# Altium schematic sheet BCM_ECU.SchDoc
size D; SheetNumber: 1; SheetTotal: 15
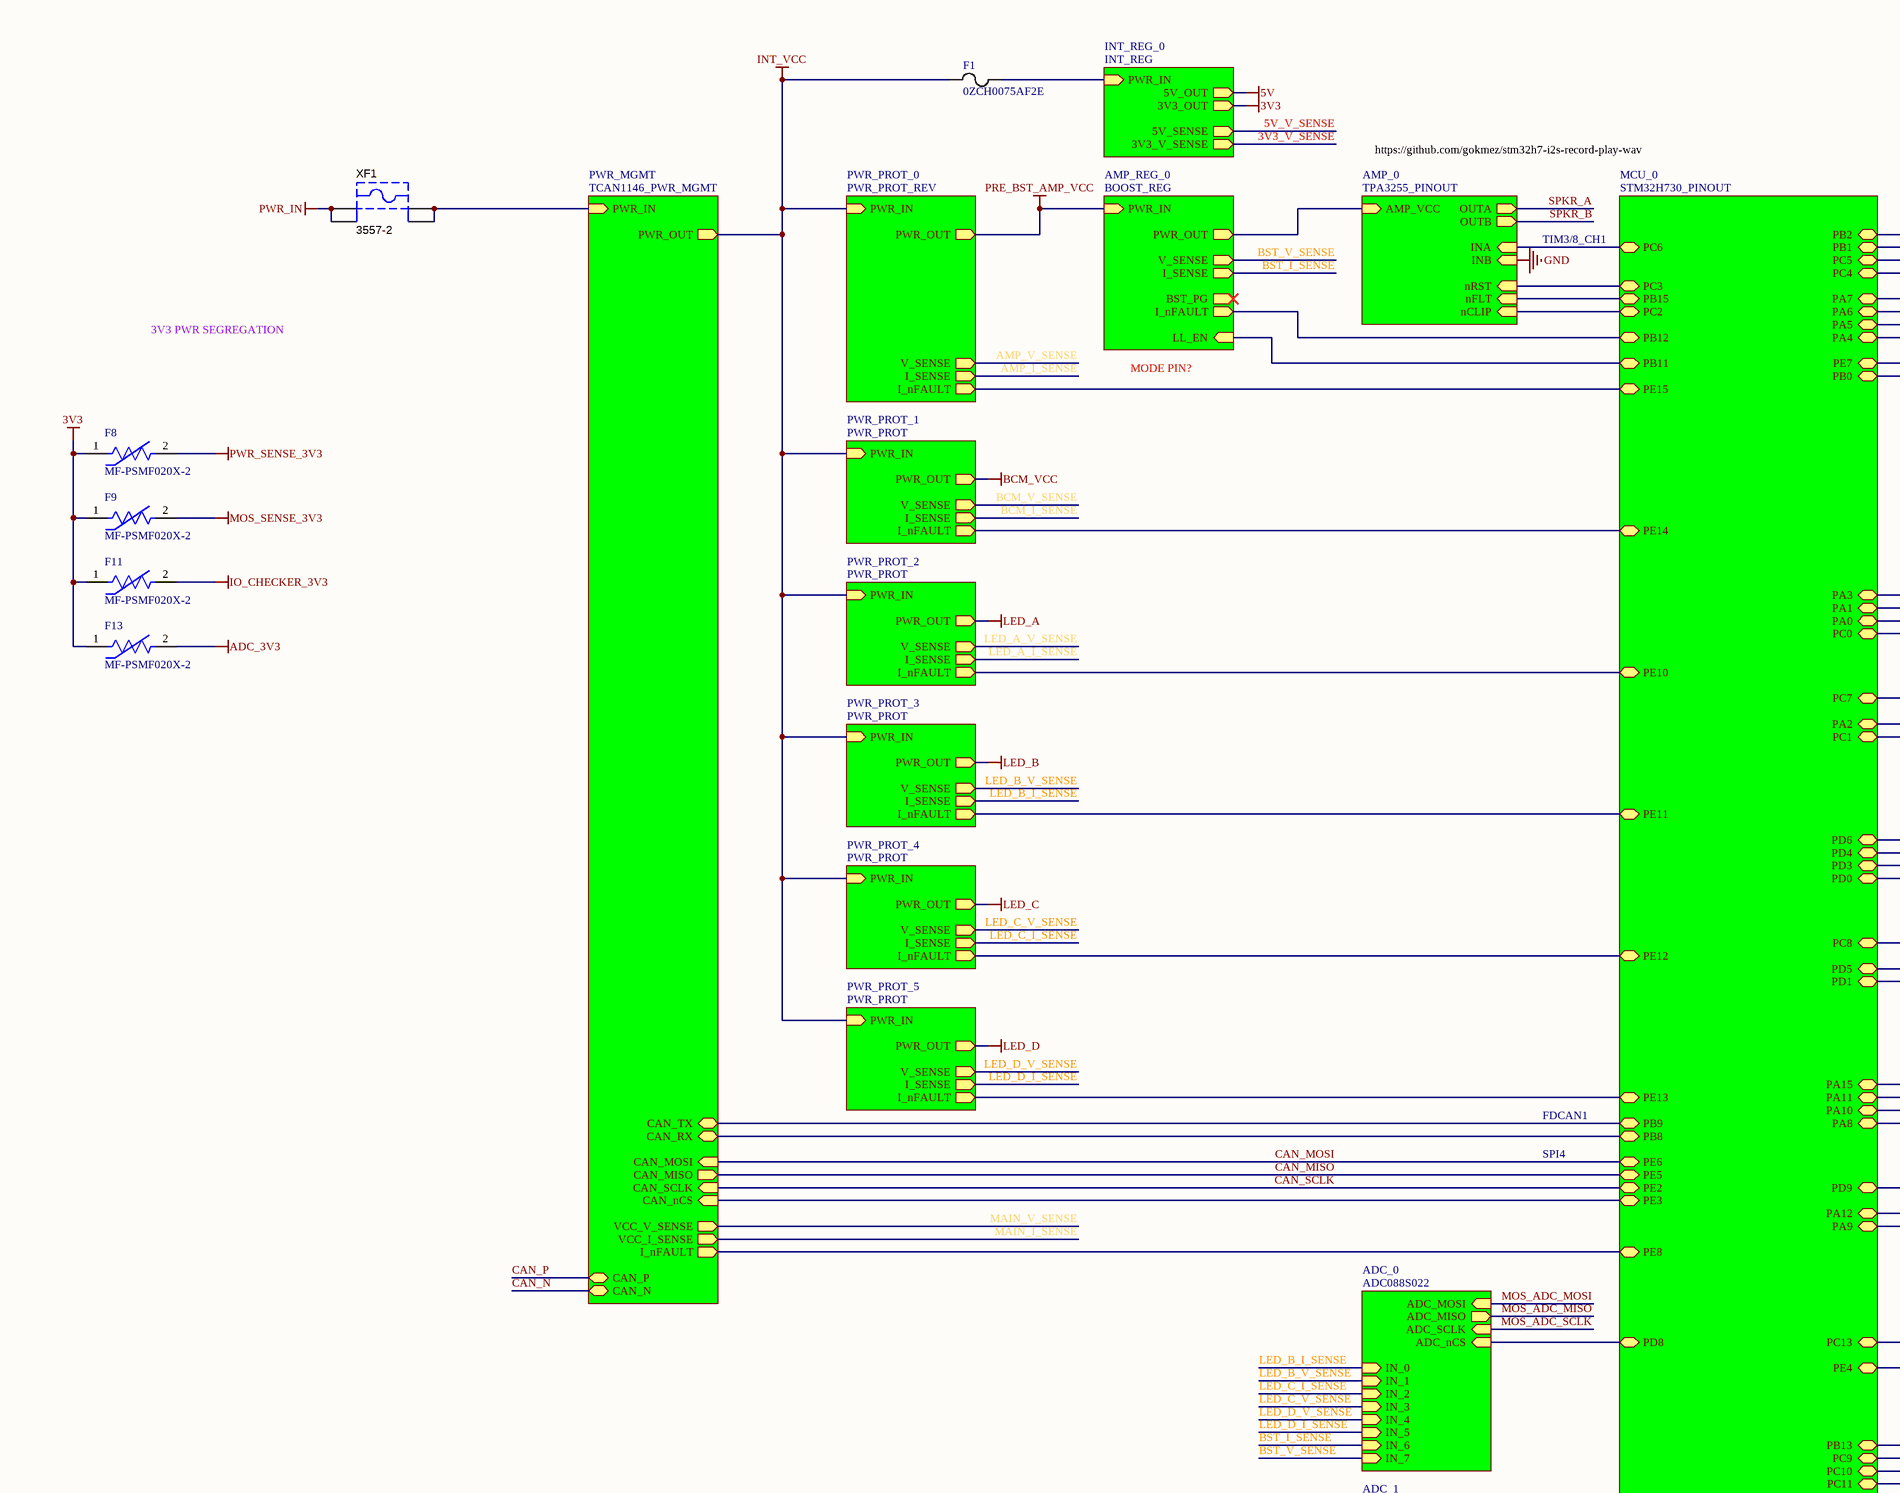
[diagram p0: BCM_ECU.SchDoc, top left]
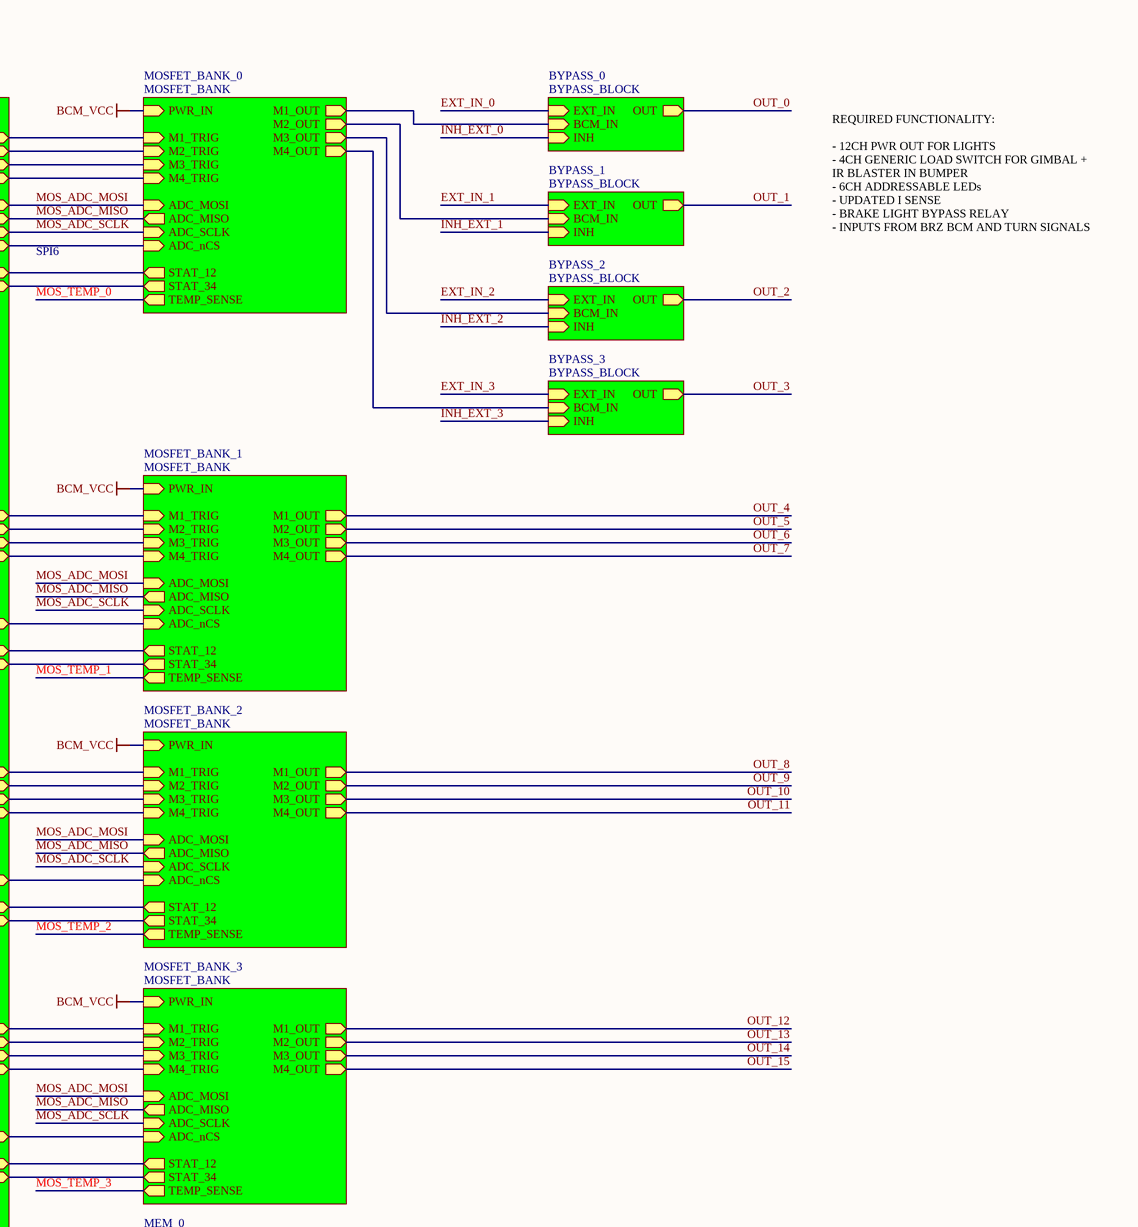
[diagram p1: BCM_ECU.SchDoc, top right]
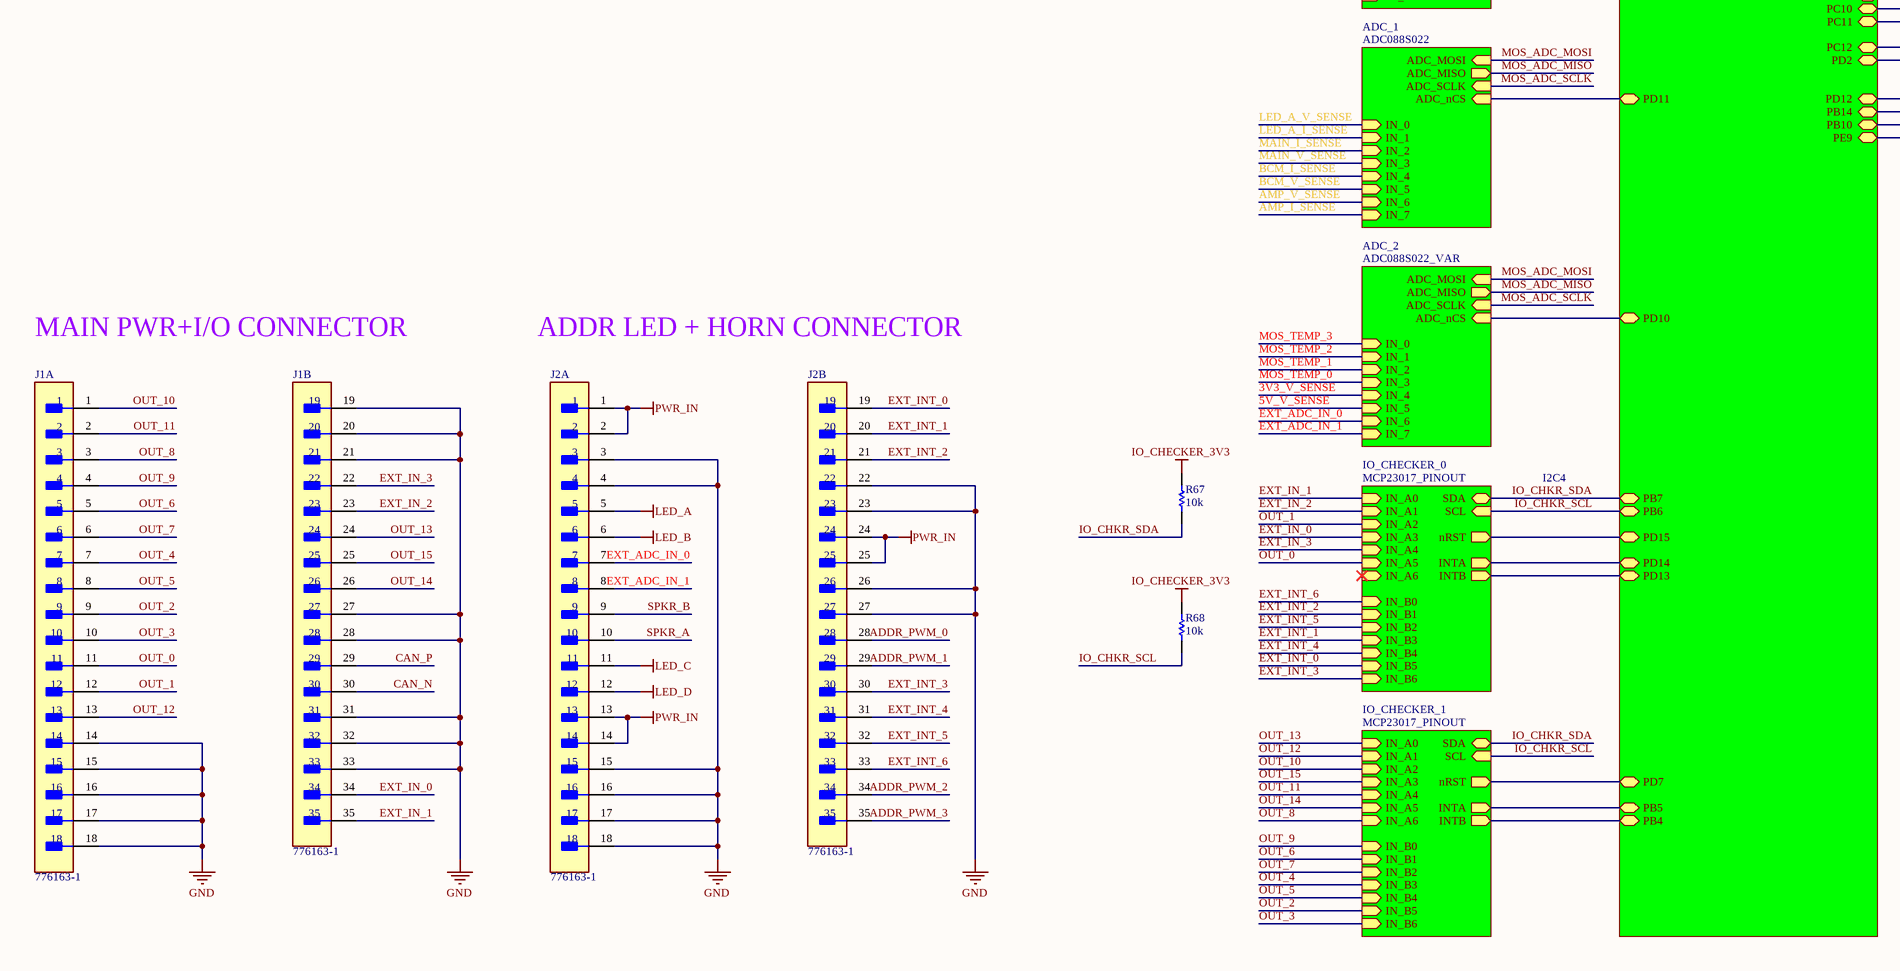
[diagram p2: BCM_ECU.SchDoc, bottom left]
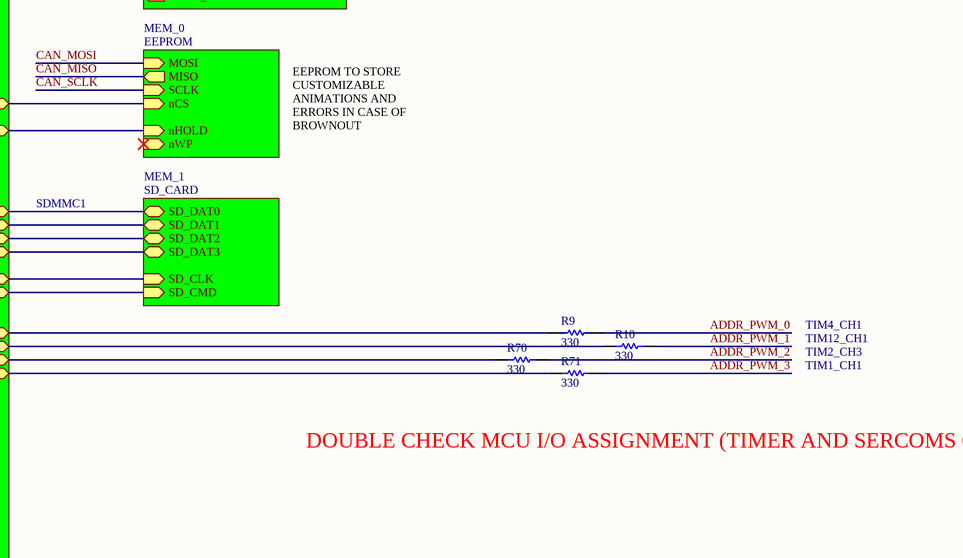
[diagram p3: BCM_ECU.SchDoc, bottom right]

## Parts
F1  0ZCH0075AF2E  [0ZCH0075AF2E-Footprint-1]
F8  MF-PSMF020X-2  [FP-MF-PSMF-MFG]
F9  MF-PSMF020X-2  [FP-MF-PSMF-MFG]
F11  MF-PSMF020X-2  [FP-MF-PSMF-MFG]
F13  MF-PSMF020X-2  [FP-MF-PSMF-MFG]
J1  776163-1  [FP-776163-1-MFG]  (parts A,B of 2)
J2  776163-1  [FP-776163-1-MFG]  (parts A,B of 2)
R9  330  [R0603B]
R10  330  [R0603B]
R67  10k  [R0603B]
R68  10k  [R0603B]
R70  330  [R0603B]
R71  330  [R0603B]
XF1  3557-2  [KSTN-3557-2]

## Sub-sheets
ADC_0 = ADC088S022: IN_0 (in), IN_1 (in), IN_2 (in), IN_3 (in), IN_4 (in), IN_5 (in), IN_6 (in), IN_7 (in), ADC_MOSI (in), ADC_MISO (out), ADC_SCLK (in), ADC_nCS (in)
ADC_1 = ADC088S022: IN_0 (in), IN_1 (in), IN_2 (in), IN_3 (in), IN_4 (in), IN_5 (in), IN_6 (in), IN_7 (in), ADC_MOSI (in), ADC_MISO (out), ADC_SCLK (in), ADC_nCS (in)
ADC_2 = ADC088S022_VAR: IN_0 (in), IN_1 (in), IN_2 (in), IN_3 (in), IN_4 (in), IN_5 (in), IN_6 (in), IN_7 (in), ADC_MOSI (in), ADC_MISO (out), ADC_SCLK (in), ADC_nCS (in)
AMP_0 = TPA3255_PINOUT: INA (in), nRST (in), nCLIP (in), nFLT (in), OUTA (out), OUTB (out), AMP_VCC (in), INB (in)
AMP_REG_0 = BOOST_REG: PWR_IN (in), PWR_OUT (out), I_SENSE (out), V_SENSE (out), I_nFAULT (out), LL_EN (in), BST_PG (out)
BYPASS_0 = BYPASS_BLOCK: EXT_IN (in), OUT (out), INH (in), BCM_IN (in)
BYPASS_1 = BYPASS_BLOCK: EXT_IN (in), OUT (out), INH (in), BCM_IN (in)
BYPASS_2 = BYPASS_BLOCK: EXT_IN (in), OUT (out), INH (in), BCM_IN (in)
BYPASS_3 = BYPASS_BLOCK: EXT_IN (in), OUT (out), INH (in), BCM_IN (in)
INT_REG_0 = INT_REG: PWR_IN (in), 3V3_OUT (out), 3V3_V_SENSE (out), 5V_SENSE (out), 5V_OUT (out)
IO_CHECKER_0 = MCP23017_PINOUT: IN_A0 (in), IN_A1 (in), IN_A2 (in), IN_A3 (in), IN_A4 (in), IN_A5 (in), IN_A6 (in), IN_B0 (in), IN_B1 (in), IN_B2 (in), IN_B3 (in), IN_B4 (in), IN_B5 (in), IN_B6 (in), SDA (bidir), SCL (in), nRST (out), INTA (out), INTB (out)
IO_CHECKER_1 = MCP23017_PINOUT: IN_A0 (in), IN_A1 (in), IN_A2 (in), IN_A3 (in), IN_A4 (in), IN_A5 (in), IN_A6 (in), IN_B0 (in), IN_B1 (in), IN_B2 (in), IN_B3 (in), IN_B4 (in), IN_B5 (in), IN_B6 (in), SDA (bidir), SCL (in), nRST (out), INTA (out), INTB (out)
MCU_0 = STM32H730_PINOUT: PB13 (bidir), PC9 (bidir), PC10 (bidir), PC11 (bidir), PC12 (bidir), PD2 (bidir), PA5 (bidir), PA6 (bidir), PA7 (bidir), PB6 (bidir), PB7 (bidir), PE2 (bidir), PE5 (bidir), PE6 (bidir), PB8 (bidir), PB9 (bidir), PB5 (bidir), PB4 (bidir), PD7 (bidir), PD6 (bidir), PD5 (bidir), PD4 (bidir), PD3 (bidir), PD1 (bidir), PD0 (bidir), PA15 (bidir), PA12 (bidir), PA11 (bidir), PA10 (bidir), PA9 (bidir), PA8 (bidir), PE3 (bidir), PE4 (bidir), PC13 (bidir), PC0 (bidir), PC1 (bidir), PA0 (bidir), PA1 (bidir), PA2 (bidir), PA3 (bidir), PC8 (bidir), PC7 (bidir), PC6 (bidir), PA4 (bidir), PC4 (bidir), PC5 (bidir), PB0 (bidir), PB1 (bidir), PB2 (bidir), PE7 (bidir), PD15 (bidir), PD14 (bidir), PD13 (bidir), PD11 (bidir), PD10 (bidir), PD8 (bidir), PE8 (bidir), PE10 (bidir), PE11 (bidir), PE12 (bidir), PE13 (bidir), PE14 (bidir), PD12 (bidir), PB14 (bidir), PB10 (bidir), PE9 (bidir), PE15 (bidir), PB11 (bidir), PD9 (bidir), PB12 (bidir), PB15 (bidir), PC2 (bidir), PC3 (bidir)
MEM_0 = EEPROM: MOSI (in), MISO (out), SCLK (in), nCS (in), nHOLD (in), nWP (in)
MEM_1 = SD_CARD: SD_DAT0 (bidir), SD_DAT1 (bidir), SD_DAT3 (bidir), SD_DAT2 (bidir), SD_CLK (in), SD_CMD (in)
MOSFET_BANK_0 = MOSFET_BANK: M1_OUT (out), M2_OUT (out), M3_OUT (out), M4_OUT (out), M1_TRIG (in), M2_TRIG (in), M3_TRIG (in), M4_TRIG (in), STAT_12 (out), STAT_34 (out), ADC_MOSI (in), ADC_MISO (out), ADC_SCLK (in), ADC_nCS (in), TEMP_SENSE (out), PWR_IN (in)
MOSFET_BANK_1 = MOSFET_BANK: M1_OUT (out), M2_OUT (out), M3_OUT (out), M4_OUT (out), M1_TRIG (in), M2_TRIG (in), M3_TRIG (in), M4_TRIG (in), STAT_12 (out), STAT_34 (out), ADC_MOSI (in), ADC_MISO (out), ADC_SCLK (in), ADC_nCS (in), TEMP_SENSE (out), PWR_IN (in)
MOSFET_BANK_2 = MOSFET_BANK: M1_OUT (out), M2_OUT (out), M3_OUT (out), M4_OUT (out), M1_TRIG (in), M2_TRIG (in), M3_TRIG (in), M4_TRIG (in), STAT_12 (out), STAT_34 (out), ADC_MOSI (in), ADC_MISO (out), ADC_SCLK (in), ADC_nCS (in), TEMP_SENSE (out), PWR_IN (in)
MOSFET_BANK_3 = MOSFET_BANK: M1_OUT (out), M2_OUT (out), M3_OUT (out), M4_OUT (out), M1_TRIG (in), M2_TRIG (in), M3_TRIG (in), M4_TRIG (in), STAT_12 (out), STAT_34 (out), ADC_MOSI (in), ADC_MISO (out), ADC_SCLK (in), ADC_nCS (in), TEMP_SENSE (out), PWR_IN (in)
PWR_MGMT = TCAN1146_PWR_MGMT: PWR_IN (in), PWR_OUT (out), CAN_TX (bidir), CAN_RX (bidir), CAN_MOSI (in), CAN_MISO (out), CAN_SCLK (in), CAN_nCS (in), VCC_V_SENSE (out), VCC_I_SENSE (out), I_nFAULT (out), CAN_P (bidir), CAN_N (bidir)
PWR_PROT_0 = PWR_PROT_REV: PWR_IN (in), PWR_OUT (out), V_SENSE (out), I_SENSE (out), I_nFAULT (out)
PWR_PROT_1 = PWR_PROT: PWR_IN (in), PWR_OUT (out), V_SENSE (out), I_SENSE (out), I_nFAULT (out)
PWR_PROT_2 = PWR_PROT: PWR_IN (in), PWR_OUT (out), V_SENSE (out), I_SENSE (out), I_nFAULT (out)
PWR_PROT_3 = PWR_PROT: PWR_IN (in), PWR_OUT (out), V_SENSE (out), I_SENSE (out), I_nFAULT (out)
PWR_PROT_4 = PWR_PROT: PWR_IN (in), PWR_OUT (out), V_SENSE (out), I_SENSE (out), I_nFAULT (out)
PWR_PROT_5 = PWR_PROT: PWR_IN (in), PWR_OUT (out), V_SENSE (out), I_SENSE (out), I_nFAULT (out)

## Nets
3V3: F8.1 F9.1 F11.1 F13.1 ; sheet INT_REG_0/3V3_OUT
5V: sheet INT_REG_0/5V_OUT
ADC_3V3: F13.2
BCM_VCC: sheet MOSFET_BANK_0/PWR_IN, sheet MOSFET_BANK_1/PWR_IN, sheet MOSFET_BANK_2/PWR_IN, sheet MOSFET_BANK_3/PWR_IN, sheet PWR_PROT_1/PWR_OUT
GND: J1.14 J1.15 J1.16 J1.17 J1.18 J1.19 J1.20 J1.21 J1.27 J1.28 J1.31 J1.32 J1.33 J2.3 J2.4 J2.15 J2.16 J2.17 J2.18 J2.22 J2.23 J2.26 J2.27 ; sheet AMP_0/INB
INT_VCC: F1.1 ; sheet PWR_MGMT/PWR_OUT, sheet PWR_PROT_0/PWR_IN, sheet PWR_PROT_1/PWR_IN, sheet PWR_PROT_2/PWR_IN, sheet PWR_PROT_3/PWR_IN, sheet PWR_PROT_4/PWR_IN, sheet PWR_PROT_5/PWR_IN
IO_CHECKER_3V3: F11.2 R67.2 R68.2
LED_A: J2.5 ; sheet PWR_PROT_2/PWR_OUT
LED_B: J2.6 ; sheet PWR_PROT_3/PWR_OUT
LED_C: J2.11 ; sheet PWR_PROT_4/PWR_OUT
LED_D: J2.12 ; sheet PWR_PROT_5/PWR_OUT
MOS_SENSE_3V3: F9.2
PRE_BST_AMP_VCC: sheet AMP_REG_0/PWR_IN, sheet PWR_PROT_0/PWR_OUT
PWR_IN: J2.1 J2.2 J2.13 J2.14 J2.24 J2.25 XF1.1 XF1.2
PWR_SENSE_3V3: F8.2
3V3_V_SENSE: sheet INT_REG_0/3V3_V_SENSE, sheet ADC_2/IN_4
5V_V_SENSE: sheet INT_REG_0/5V_SENSE, sheet ADC_2/IN_5
ADDR_PWM_0: J2.28 R9.1
ADDR_PWM_1: J2.29 R10.1
ADDR_PWM_2: J2.34 R70.1
ADDR_PWM_3: J2.35 R71.1
AMP_I_SENSE: sheet PWR_PROT_0/I_SENSE, sheet ADC_1/IN_7
AMP_V_SENSE: sheet PWR_PROT_0/V_SENSE, sheet ADC_1/IN_6
BCM_I_SENSE: sheet PWR_PROT_1/I_SENSE, sheet ADC_1/IN_4
BCM_V_SENSE: sheet PWR_PROT_1/V_SENSE, sheet ADC_1/IN_5
BST_I_SENSE: sheet ADC_0/IN_6, sheet AMP_REG_0/I_SENSE
BST_V_SENSE: sheet ADC_0/IN_7, sheet AMP_REG_0/V_SENSE
CAN_MISO: sheet MCU_0/PE5, sheet PWR_MGMT/CAN_MISO, sheet MEM_0/MISO
CAN_MOSI: sheet MCU_0/PE6, sheet PWR_MGMT/CAN_MOSI, sheet MEM_0/MOSI
CAN_N: J1.30 ; sheet PWR_MGMT/CAN_N
CAN_P: J1.29 ; sheet PWR_MGMT/CAN_P
CAN_SCLK: sheet MCU_0/PE2, sheet PWR_MGMT/CAN_SCLK, sheet MEM_0/SCLK
EXT_ADC_IN_0: J2.7 ; sheet ADC_2/IN_6
EXT_ADC_IN_1: J2.8 ; sheet ADC_2/IN_7
EXT_IN_0: J1.34 ; sheet BYPASS_0/EXT_IN, sheet IO_CHECKER_0/IN_A3
EXT_IN_1: J1.35 ; sheet BYPASS_1/EXT_IN, sheet IO_CHECKER_0/IN_A0
EXT_IN_2: J1.23 ; sheet BYPASS_2/EXT_IN, sheet IO_CHECKER_0/IN_A1
EXT_IN_3: J1.22 ; sheet BYPASS_3/EXT_IN, sheet IO_CHECKER_0/IN_A4
EXT_INT_0: J2.19 ; sheet IO_CHECKER_0/IN_B5
EXT_INT_1: J2.20 ; sheet IO_CHECKER_0/IN_B3
EXT_INT_2: J2.21 ; sheet IO_CHECKER_0/IN_B1
EXT_INT_3: J2.30 ; sheet IO_CHECKER_0/IN_B6
EXT_INT_4: J2.31 ; sheet IO_CHECKER_0/IN_B4
EXT_INT_5: J2.32 ; sheet IO_CHECKER_0/IN_B2
EXT_INT_6: J2.33 ; sheet IO_CHECKER_0/IN_B0
INH_EXT_0: sheet BYPASS_0/INH
INH_EXT_1: sheet BYPASS_1/INH
INH_EXT_2: sheet BYPASS_2/INH
INH_EXT_3: sheet BYPASS_3/INH
IO_CHKR_SCL: R68.1 ; sheet MCU_0/PB6, sheet IO_CHECKER_0/SCL, sheet IO_CHECKER_1/SCL
IO_CHKR_SDA: R67.1 ; sheet MCU_0/PB7, sheet IO_CHECKER_0/SDA, sheet IO_CHECKER_1/SDA
LED_A_I_SENSE: sheet PWR_PROT_2/I_SENSE, sheet ADC_1/IN_1
LED_A_V_SENSE: sheet PWR_PROT_2/V_SENSE, sheet ADC_1/IN_0
LED_B_I_SENSE: sheet ADC_0/IN_0, sheet PWR_PROT_3/I_SENSE
LED_B_V_SENSE: sheet ADC_0/IN_1, sheet PWR_PROT_3/V_SENSE
LED_C_I_SENSE: sheet ADC_0/IN_2, sheet PWR_PROT_4/I_SENSE
LED_C_V_SENSE: sheet ADC_0/IN_3, sheet PWR_PROT_4/V_SENSE
LED_D_I_SENSE: sheet ADC_0/IN_5, sheet PWR_PROT_5/I_SENSE
LED_D_V_SENSE: sheet ADC_0/IN_4, sheet PWR_PROT_5/V_SENSE
MAIN_I_SENSE: sheet PWR_MGMT/VCC_I_SENSE, sheet ADC_1/IN_2
MAIN_V_SENSE: sheet PWR_MGMT/VCC_V_SENSE, sheet ADC_1/IN_3
MOS_ADC_MISO: sheet MCU_0/PA6, sheet MOSFET_BANK_0/ADC_MISO, sheet MOSFET_BANK_1/ADC_MISO, sheet MOSFET_BANK_2/ADC_MISO, sheet ADC_0/ADC_MISO, sheet MOSFET_BANK_3/ADC_MISO, sheet ADC_1/ADC_MISO, sheet ADC_2/ADC_MISO
MOS_ADC_MOSI: sheet MCU_0/PA7, sheet MOSFET_BANK_0/ADC_MOSI, sheet MOSFET_BANK_1/ADC_MOSI, sheet MOSFET_BANK_2/ADC_MOSI, sheet ADC_0/ADC_MOSI, sheet MOSFET_BANK_3/ADC_MOSI, sheet ADC_1/ADC_MOSI, sheet ADC_2/ADC_MOSI
MOS_ADC_SCLK: sheet MCU_0/PA5, sheet MOSFET_BANK_0/ADC_SCLK, sheet MOSFET_BANK_1/ADC_SCLK, sheet MOSFET_BANK_2/ADC_SCLK, sheet ADC_0/ADC_SCLK, sheet MOSFET_BANK_3/ADC_SCLK, sheet ADC_1/ADC_SCLK, sheet ADC_2/ADC_SCLK
MOS_TEMP_0: sheet MOSFET_BANK_0/TEMP_SENSE, sheet ADC_2/IN_3
MOS_TEMP_1: sheet MOSFET_BANK_1/TEMP_SENSE, sheet ADC_2/IN_2
MOS_TEMP_2: sheet MOSFET_BANK_2/TEMP_SENSE, sheet ADC_2/IN_1
MOS_TEMP_3: sheet MOSFET_BANK_3/TEMP_SENSE, sheet ADC_2/IN_0
OUT_0: J1.11 ; sheet BYPASS_0/OUT, sheet IO_CHECKER_0/IN_A5
OUT_1: J1.12 ; sheet BYPASS_1/OUT, sheet IO_CHECKER_0/IN_A2
OUT_2: J1.9 ; sheet BYPASS_2/OUT, sheet IO_CHECKER_1/IN_B5
OUT_3: J1.10 ; sheet BYPASS_3/OUT, sheet IO_CHECKER_1/IN_B6
OUT_4: J1.7 ; sheet MOSFET_BANK_1/M1_OUT, sheet IO_CHECKER_1/IN_B3
OUT_5: J1.8 ; sheet MOSFET_BANK_1/M2_OUT, sheet IO_CHECKER_1/IN_B4
OUT_6: J1.5 ; sheet MOSFET_BANK_1/M3_OUT, sheet IO_CHECKER_1/IN_B1
OUT_7: J1.6 ; sheet MOSFET_BANK_1/M4_OUT, sheet IO_CHECKER_1/IN_B2
OUT_8: J1.3 ; sheet MOSFET_BANK_2/M1_OUT, sheet IO_CHECKER_1/IN_A6
OUT_9: J1.4 ; sheet MOSFET_BANK_2/M2_OUT, sheet IO_CHECKER_1/IN_B0
OUT_10: J1.1 ; sheet MOSFET_BANK_2/M3_OUT, sheet IO_CHECKER_1/IN_A2
OUT_11: J1.2 ; sheet MOSFET_BANK_2/M4_OUT, sheet IO_CHECKER_1/IN_A4
OUT_12: J1.13 ; sheet MOSFET_BANK_3/M1_OUT, sheet IO_CHECKER_1/IN_A1
OUT_13: J1.24 ; sheet MOSFET_BANK_3/M2_OUT, sheet IO_CHECKER_1/IN_A0
OUT_14: J1.26 ; sheet MOSFET_BANK_3/M3_OUT, sheet IO_CHECKER_1/IN_A5
OUT_15: J1.25 ; sheet MOSFET_BANK_3/M4_OUT, sheet IO_CHECKER_1/IN_A3
SPKR_A: J2.10 ; sheet AMP_0/OUTA
SPKR_B: J2.9 ; sheet AMP_0/OUTB
NetF1_2: F1.2 ; sheet INT_REG_0/PWR_IN
NetR9_2: R9.2 ; sheet MCU_0/PD12
NetR10_2: R10.2 ; sheet MCU_0/PB14
NetR70_2: R70.2 ; sheet MCU_0/PB10
NetR71_2: R71.2 ; sheet MCU_0/PE9
NetXF1_3: XF1.3 XF1.4 ; sheet PWR_MGMT/PWR_IN
(unnamed): sheet MCU_0/PB13, sheet MEM_1/SD_DAT0
(unnamed): sheet MCU_0/PC9, sheet MEM_1/SD_DAT1
(unnamed): sheet MCU_0/PC10, sheet MEM_1/SD_DAT2
(unnamed): sheet MCU_0/PC11, sheet MEM_1/SD_DAT3
(unnamed): sheet MCU_0/PC12, sheet MEM_1/SD_CLK
(unnamed): sheet MCU_0/PD2, sheet MEM_1/SD_CMD
(unnamed): sheet MCU_0/PB8, sheet PWR_MGMT/CAN_RX
(unnamed): sheet MCU_0/PB9, sheet PWR_MGMT/CAN_TX
(unnamed): sheet MCU_0/PB5, sheet IO_CHECKER_1/INTA
(unnamed): sheet MCU_0/PB4, sheet IO_CHECKER_1/INTB
(unnamed): sheet MCU_0/PD7, sheet IO_CHECKER_1/nRST
(unnamed): sheet MCU_0/PD6, sheet MOSFET_BANK_2/M1_TRIG
(unnamed): sheet MCU_0/PD5, sheet MOSFET_BANK_2/STAT_12
(unnamed): sheet MCU_0/PD4, sheet MOSFET_BANK_2/M2_TRIG
(unnamed): sheet MCU_0/PD3, sheet MOSFET_BANK_2/M3_TRIG
(unnamed): sheet MCU_0/PD1, sheet MOSFET_BANK_2/STAT_34
(unnamed): sheet MCU_0/PD0, sheet MOSFET_BANK_2/M4_TRIG
(unnamed): sheet MCU_0/PA15, sheet MOSFET_BANK_3/M1_TRIG
(unnamed): sheet MCU_0/PA12, sheet MOSFET_BANK_3/STAT_12
(unnamed): sheet MCU_0/PA11, sheet MOSFET_BANK_3/M2_TRIG
(unnamed): sheet MCU_0/PA10, sheet MOSFET_BANK_3/M3_TRIG
(unnamed): sheet MCU_0/PA9, sheet MOSFET_BANK_3/STAT_34
(unnamed): sheet MCU_0/PA8, sheet MOSFET_BANK_3/M4_TRIG
(unnamed): sheet MCU_0/PE3, sheet PWR_MGMT/CAN_nCS
(unnamed): sheet MCU_0/PE4, sheet MEM_0/nHOLD
(unnamed): sheet MCU_0/PC13, sheet MEM_0/nCS
(unnamed): sheet MCU_0/PC0, sheet MOSFET_BANK_1/M4_TRIG
(unnamed): sheet MCU_0/PC1, sheet MOSFET_BANK_1/STAT_34
(unnamed): sheet MCU_0/PA0, sheet MOSFET_BANK_1/M3_TRIG
(unnamed): sheet MCU_0/PA1, sheet MOSFET_BANK_1/M2_TRIG
(unnamed): sheet MCU_0/PA2, sheet MOSFET_BANK_1/STAT_12
(unnamed): sheet MCU_0/PA3, sheet MOSFET_BANK_1/M1_TRIG
(unnamed): sheet MCU_0/PC8, sheet MOSFET_BANK_2/ADC_nCS
(unnamed): sheet MCU_0/PC7, sheet MOSFET_BANK_1/ADC_nCS
(unnamed): sheet MCU_0/PC6, sheet AMP_0/INA
(unnamed): sheet MCU_0/PA4, sheet MOSFET_BANK_0/ADC_nCS
(unnamed): sheet MCU_0/PC4, sheet MOSFET_BANK_0/M4_TRIG
(unnamed): sheet MCU_0/PC5, sheet MOSFET_BANK_0/M3_TRIG
(unnamed): sheet MCU_0/PB0, sheet MOSFET_BANK_0/STAT_34
(unnamed): sheet MCU_0/PB1, sheet MOSFET_BANK_0/M2_TRIG
(unnamed): sheet MCU_0/PB2, sheet MOSFET_BANK_0/M1_TRIG
(unnamed): sheet MCU_0/PE7, sheet MOSFET_BANK_0/STAT_12
(unnamed): sheet MCU_0/PD15, sheet IO_CHECKER_0/nRST
(unnamed): sheet MCU_0/PD14, sheet IO_CHECKER_0/INTA
(unnamed): sheet MCU_0/PD13, sheet IO_CHECKER_0/INTB
(unnamed): sheet MCU_0/PD11, sheet ADC_1/ADC_nCS
(unnamed): sheet MCU_0/PD10, sheet ADC_2/ADC_nCS
(unnamed): sheet MCU_0/PD8, sheet ADC_0/ADC_nCS
(unnamed): sheet MCU_0/PE8, sheet PWR_MGMT/I_nFAULT
(unnamed): sheet MCU_0/PE10, sheet PWR_PROT_2/I_nFAULT
(unnamed): sheet MCU_0/PE11, sheet PWR_PROT_3/I_nFAULT
(unnamed): sheet MCU_0/PE12, sheet PWR_PROT_4/I_nFAULT
(unnamed): sheet MCU_0/PE13, sheet PWR_PROT_5/I_nFAULT
(unnamed): sheet MCU_0/PE14, sheet PWR_PROT_1/I_nFAULT
(unnamed): sheet MCU_0/PE15, sheet PWR_PROT_0/I_nFAULT
(unnamed): sheet MCU_0/PB11, sheet AMP_REG_0/LL_EN
(unnamed): sheet MCU_0/PD9, sheet MOSFET_BANK_3/ADC_nCS
(unnamed): sheet MCU_0/PB12, sheet AMP_REG_0/I_nFAULT
(unnamed): sheet MCU_0/PB15, sheet AMP_0/nFLT
(unnamed): sheet MCU_0/PC2, sheet AMP_0/nCLIP
(unnamed): sheet MCU_0/PC3, sheet AMP_0/nRST
(unnamed): sheet MOSFET_BANK_0/M1_OUT, sheet BYPASS_0/BCM_IN
(unnamed): sheet MOSFET_BANK_0/M2_OUT, sheet BYPASS_1/BCM_IN
(unnamed): sheet MOSFET_BANK_0/M3_OUT, sheet BYPASS_2/BCM_IN
(unnamed): sheet MOSFET_BANK_0/M4_OUT, sheet BYPASS_3/BCM_IN
(unnamed): sheet AMP_REG_0/PWR_OUT, sheet AMP_0/AMP_VCC

## Notes on the sheet
- https://github.com/gokmez/stm32h7-i2s-record-play-wav
- TIM3/8_CH1
- 3V3 PWR SEGREGATION
- SPI6
- REQUIRED FUNCTIONALITY:
  - 12CH PWR OUT FOR LIGHTS
  - 4CH GENERIC LOAD SWITCH FOR GIMBAL + IR BLASTER IN BUMPER
  - 6CH ADDRESSABLE LEDs
  - UPDATED I SENSE
  - BRAKE LIGHT BYPASS RELAY
  - INPUTS FROM BRZ BCM AND TURN SIGNALS
- MODE PIN?
- FDCAN1
- SPI4
- EEPROM TO STORE CUSTOMIZABLE ANIMATIONS AND ERRORS IN CASE OF BROWNOUT
- SDMMC1
- TIM4_CH1
- TIM12_CH1
- TIM2_CH3
- TIM1_CH1
- DOUBLE CHECK MCU I/O ASSIGNMENT (TIMER AND SERCOMS CORRECT)
- MAIN PWR+I/O CONNECTOR
- ADDR LED + HORN CONNECTOR
- I2C4

## Library data of the parts
F1 = CMP-005-00028-2: PTC Thermistor; RoHS Compliant: Yes
F8 F9 F11 F13 = CMP-07400-000005-1: PTC RESET FUSE 9V 200MA 0805; Manufacturer: Bourns; Trip Current: 0.5A; Resistance: 0.65-3.5Ω; Current Rating: 40A; Value: 0.65-3.5Ω; Trip Time: 0.02s; Hold Current: 0.2A; ComponentLink2Description: Datasheet; Manufacturer Part Number: MF-PSMF020X-2; Height: 0.85mm; Ambient Temperature Range High: +85°C; Category: Fuse; Temperature Range Low: -40°C; ComponentLink2URL: https://www.bourns.com/docs/Product-Datasheets/mfpsmf.pdf; Temperature Range High: +85°C; RoHS: TRUE; Device Class L1: Circuit Protection; Device Class L3: unset; Package: MF-PSMF; Digikey Description: PTC RESET FUSE 9V 200MA 0805; Mouser Description: PTC Resettable Fuse 0.2A(hold) 0.5A(trip) 9V 40A 0.5W 0.02s 0.65Ohm SMD Solder Pad 0805 T/R; Voltage Rating: 9V; Automotive: No; Device Class L2: PTC Resettable Fuses; Temperature: -40°C to +85°C; Lead Free: Yes; Octopart: https://octopart.com/mf-psmf020x-2-bourns-7483437; Ambient Temperature Range Low: -40°C
J1 J2 = CMP-03369-000154-1: CONN HEADER R/A 35POS 4MM; Primary Type: Rectangular; Circuit Application: Power; Tab Thickness: 1.3mm; Number of Signal Positions: 35; Shielding: Unshielded; Pitch: 0.157inch; Max Voltage Rating (AC): 250V; Connector System: Wire-to-Device; Insulation: Insulated; Current Rating: 17A; PCB Thickness: 0.062inch; PCB Mount Retention: With; Gender: Male; Connector Type: Male Pin; PCB Mount Alignment: Yes (With); Series: Ampseal; Depth: 37.9mm; Orientation: Right Angle; Length: 3.03inch; Termination: Solder; Radiation Hardening: No; Number of Rows: 3; Contact Plating: Tin; Lead Free: Lead Free; Flammability Rating: UL94 V-0; Contact Material: Brass; Number of Contacts: 35; ELV: Compliant; Max Operating Temperature: 221°C; Min Operating Temperature: -40°C; Package Quantity: 1; Mount: Through Hole; Contact Type: Male Pin; Housing Material: Thermoplastic; Number of Positions: 35; Packaging: Bulk; Row Spacing: 0.157inch; RoHS Compliant: Yes; Height: 32.1mm; Color: Black; Fastening Type: Ramp; Sealable: Yes (With); Width: 37.9mm
R9 R10 R70 R71 = CMP-009-00002-14: Resistor; Value: 330
R67 R68 = CMP-009-00002-14: Resistor; Value: 100k
XF1 = CMP-2000-05461-1: FUSE HOLDER, PCB MOUNT, 500VAC, 20A, ROHS; Manufacturer: Keystone-Electronics; Number of Circuits: 1; Voltage: 500V; Fuseholder Type: Block; Fuse Type: Blade; Fuse Size: 0.43"Lx0.15"Wx0.64"H(10.92mmx3.81mmx16.25mm); For Use With/Related Products: ATC,ATO257,MINI897; Current Rating: 30A; Datasheet URL: http://datasheet.octopart.com/3557-2-Keystone-datasheet-15715937.pdf; Orientation: Vertical; Family: Fuseholders; Datasheet Version: Apr-13; Contact Finish: TinNickel; Mounting Type: PCB; Series: -; Category: CircuitProtection; Termination Style: PCPin; Contact Material: Brass; Manufacturer URL: http://www.keyelco.com/